# Altium schematic sheet node_nrf52.SchDoc
size A3; SheetNumber: 1; SheetTotal: 1
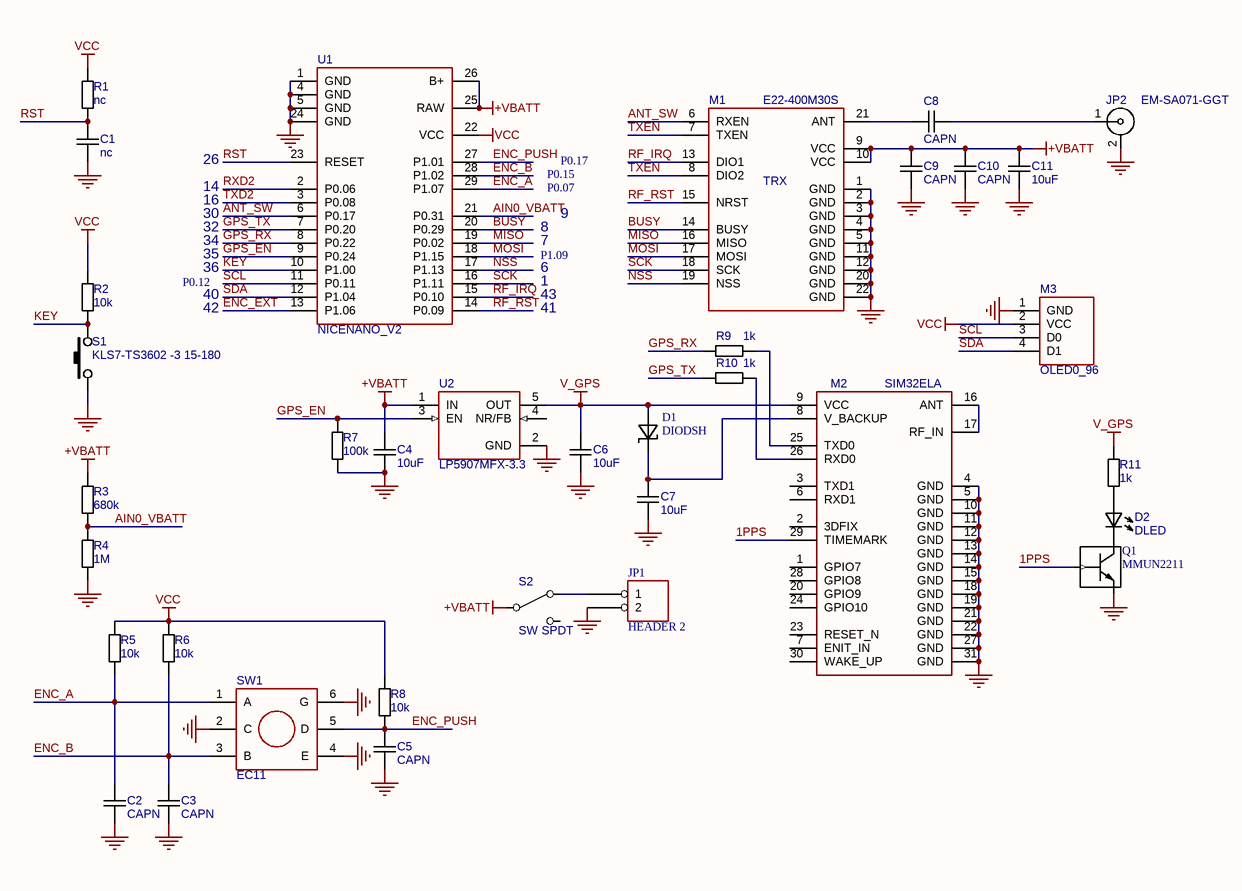
[diagram p0: node_nrf52.SchDoc]

## Parts
C1  nc  [C-0603]
C2  CAPN  [C-0603]
C3  CAPN  [C-0603]
C4  10uF  [C-0805]
C5  CAPN  [C-0603]
C6  10uF  [C-0805]
C7  10uF  [C-0805]
C8  CAPN  [C-0603]
C9  CAPN  [C-0603]
C10  CAPN  [C-0603]
C11  10uF  [C-0805]
D1  DIODSH  [SOD80]
D2  DLED  [LED_3mm_RED]
JP1  HEADER 2  [PLS1-2]
JP2  EM-SA071-GGT  [SMA_F_EDGE]
M1  E22-400M30S  [PE22(400M30S)]
M2  SIM32ELA  [LGA_SIM32]
M3  OLED0_96  [OLED096_I2C]
Q1  MMUN2211  [SOT-23]
R1  nc  [R-0603]
R2  10k  [R-0603]
R3  680k  [R-0603]
R4  1M  [R-0603]
R5  10k  [R-0603]
R6  10k  [R-0603]
R7  100k  [R-0603]
R8  10k  [R-0603]
R9  1k  [R-0603]
R10  1k  [R-0603]
R11  1k  [R-0603]
S1  KLS7-TS3602 -3 15-180  [BUTT_MIN]
S2  SW SPDT  [SK-12D07VG5]
SW1  EC11  [EC11]
U1  NICENANO_V2  [NICENANO_SMD]
U2  LP5907MFX-3.3  [SOT-23-5]

## Nets
+VBATT: C4.1 C9.1 C10.1 C11.1 M1.9(VCC) M1.10(VCC) R3.2 S2.2(COMMON) U1.25(RAW) U1.26(B+) U2.1(IN)
GND: C1.2 C2.2 C3.2 C4.2 C5.2 C6.2 C7.2 C9.2 C10.2 C11.2 JP1.2 JP2.2 M1.1(GND) M1.2(GND) M1.3(GND) M1.4(GND) M1.5(GND) M1.11(GND) M1.12(GND) M1.20(GND) M1.22(GND) M2.4(GND) M2.5(GND) M2.10(GND) M2.11(GND) M2.12(GND) M2.13(GND) M2.14(GND) M2.15(GND) M2.18(GND) M2.19(GND) M2.21(GND) M2.22(GND) M2.27(GND) M2.31(GND) M3.1(GND) Q1.2(EMITTER) R4.1 R7.1 S1.1 SW1.2(C) SW1.4(E) SW1.6(G) U1.1(GND) U1.4(GND) U1.5(GND) U1.24(GND) U2.2(GND)
V_GPS: C6.1 D1.1 M2.9(VCC) R11.2 U2.5(OUT)
VCC: M3.2(VCC) R1.2 R2.1 R5.1 R6.1 R8.1 U1.22(VCC)
1PPS: M2.29(TIMEMARK) Q1.1(BASE)
AIN0_VBATT: R3.1 R4.2 U1.21(P0.31)
ANT_SW: M1.6(RXEN) U1.6(P0.17)
BUSY: M1.14(BUSY) U1.20(P0.29)
ENC_A: C2.1 R5.2 SW1.1(A) U1.29(P1.07)
ENC_B: C3.1 R6.2 SW1.3(B) U1.28(P1.02)
ENC_EXT: U1.13(P1.06)
ENC_PUSH: C5.1 R8.2 SW1.5(D) U1.27(P1.01)
GPS_EN: R7.2 U1.9(P0.24) U2.3(EN)
GPS_RX: R9.2 U1.8(P0.22)
GPS_TX: R10.2 U1.7(P0.20)
KEY: R2.2 S1.2 U1.10(P1.00)
MISO: M1.16(MISO) U1.19(P0.02)
MOSI: M1.17(MOSI) U1.18(P1.15)
NSS: M1.19(NSS) U1.17(P1.13)
RF_IRQ: M1.13(DIO1) U1.15(P0.10)
RF_RST: M1.15(NRST) U1.14(P0.09)
RST: C1.1 R1.1 U1.23(RESET)
RXD2: U1.2(P0.06)
SCK: M1.18(SCK) U1.16(P1.11)
SCL: M3.3(D0) U1.11(P0.11)
SDA: M3.4(D1) U1.12(P1.04)
TXD2: U1.3(P0.08)
TXEN: M1.7(TXEN) M1.8(DIO2)
NetC7_1: C7.1 D1.2 M2.8(V_BACKUP)
NetC8_1: C8.1 M1.21(ANT)
NetC8_2: C8.2 JP2.1
NetD2_1: D2.1 R11.1
NetD2_2: D2.2 Q1.3(COLLECTOR)
NetJP1_1: JP1.1 S2.1(NC)
NetM2_16: M2.16(ANT) M2.17(RF_IN)
NetM2_25: M2.25(TXD0) R9.1
NetM2_26: M2.26(RXD0) R10.1

Not connected (* = marked no-connect by the designer): M2 1(GPIO7) 2(3DFIX) 3(TXD1) 6(RXD1) 7(ENIT_IN) 20(GPIO9) 23(RESET_N) 24(GPIO10) 28(GPIO8) 30(WAKE_UP); S2 3(NO); U2 4(NR/FB)

## Notes on the sheet
- 26
- 14
- P0.07
- P0.15
- P0.17
- 16
- 30
- 32
- 34
- 7
- 8
- 9
- P0.12
- 35
- 36
- 40
- 42
- 41
- 43
- 1
- 6
- P1.09
- (in symbol E22) TRX

## Library data of the parts
C1-C11 = CAPN: Voltage: 50V; Точність/група: NP0; Вид: Конденсатор
D1 = DIODSH: Вид: Діод
D2 = DLED: Вид: Світлодіод
JP1 = HEADER 2: Вид: Роз'єм; *: *
JP2 = SMA: SMA Female R/A PCB Mount; Вид: Роз'єм
M1 = E22
M2 = SIM32ELA: Вид: Модуль
M3 = OLED0_96_I2C
Q1 = MMUN2211: Вид: Транзистор
R1-R11 = RES: Точність/група: 5%; Вид: Резистор
S1 = SW-1: Вид: Кнопка; Робоча напруга: *
S2 = SW SPDT: Вид: Перемикач; Виробник: *; *: *
U1 = NICENANO_V2: Вид: Мікросхема
U2 = LP5907: 250mA Low-Dropout Regulator; Вид: Мікросхема